# Altium schematic sheet 修改(3).SchDoc
size A4
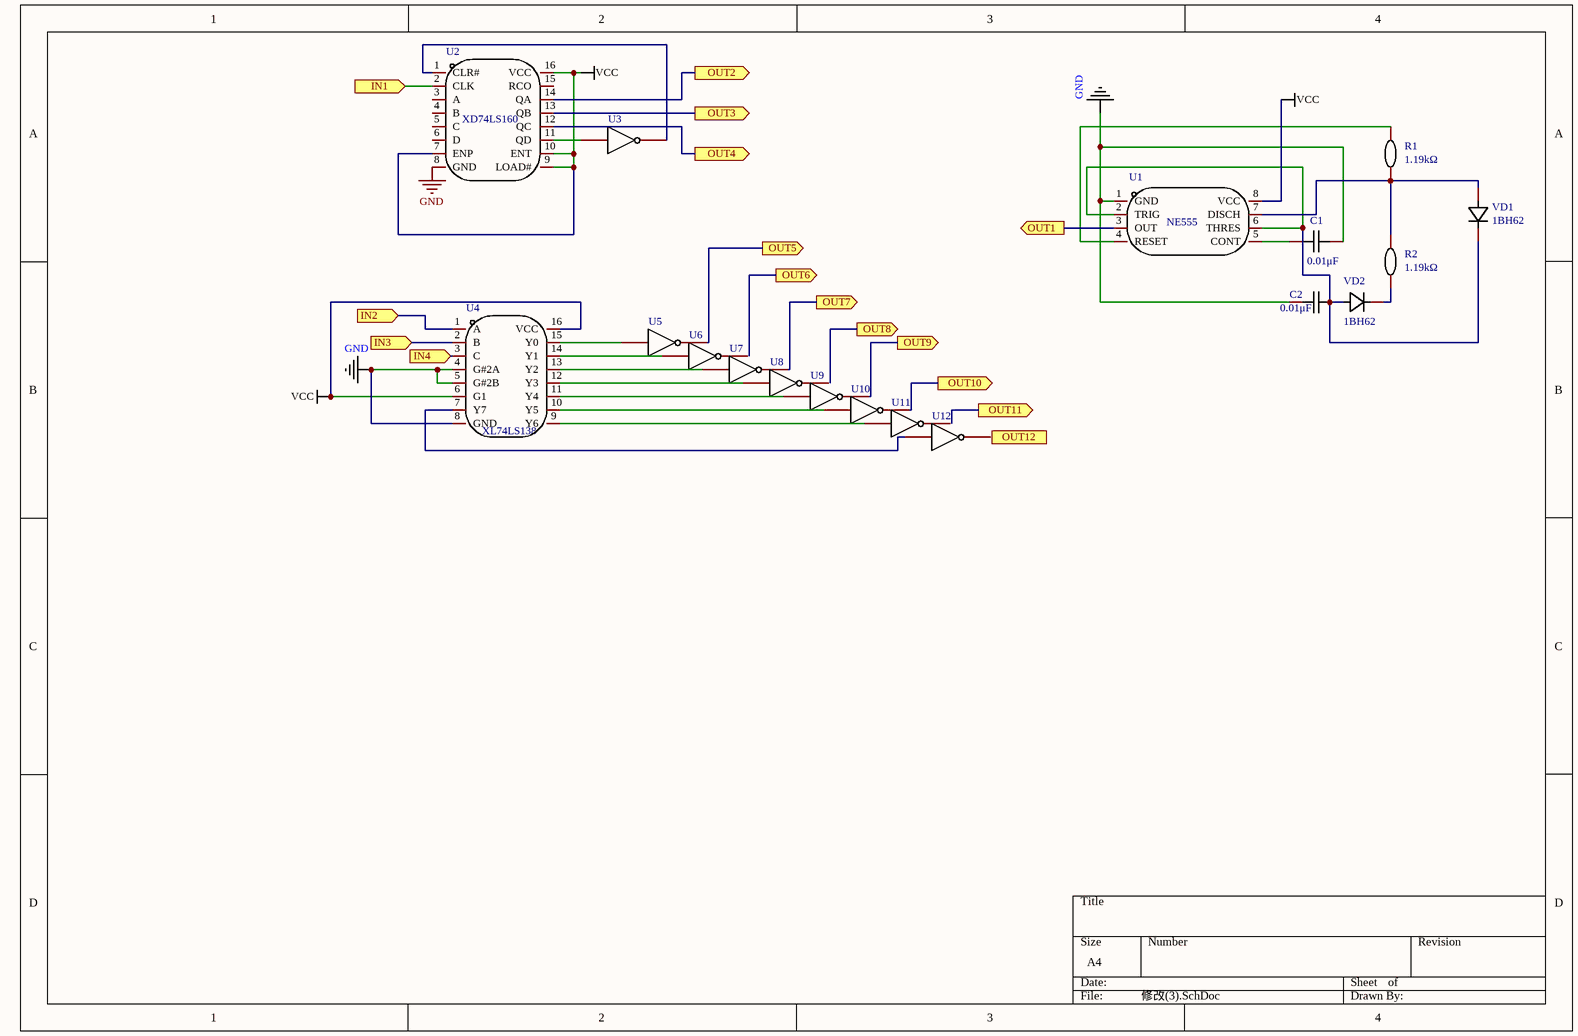
[diagram p0: 修改(3).SchDoc]

## Parts
C1  Name: 0.01μF  [C0603]  (hidden comment: 100nF)
C2  Name: 0.01μF  [C0603]  (hidden comment: 100nF)
R1  Name: 1.19kΩ  [R0603]  (hidden comment: 10K)
R2  Name: 1.19kΩ  [R0603]  (hidden comment: 10K)
U1  -  [SOIC-8_L4.9-W3.9-P1.27-LS6.0-BL]  (value not drawn)
U2  XD74LS160  [DIP-16_L19.8-W6.5-P2.54-LS7.6-BL]
U3  反相器  (value not drawn)
U4  XL74LS138  [SOP-16_L9.9-W3.9-P1.27-LS6.1-BL]
U5  反相器  (value not drawn)
U6  反相器  (value not drawn)
U7  反相器  (value not drawn)
U8  反相器  (value not drawn)
U9  反相器  (value not drawn)
U10  反相器  (value not drawn)
U11  反相器  (value not drawn)
U12  反相器  (value not drawn)
VD1  Name: 1BH62  [SMA_L4.3-W2.6-LS5.1-RD]  (hidden comment: 1N4007)
VD2  Name: 1BH62  [SMA_L4.3-W2.6-LS5.1-RD]  (hidden comment: 1N4007)

## Ports
IN1 (in), IN2 (in), IN3 (in), IN4 (in), OUT1 (out), OUT2 (out), OUT3 (out), OUT4 (out), OUT5 (out), OUT6 (out), OUT7 (out), OUT8 (out), OUT9 (out), OUT10 (out), OUT11 (out), OUT12 (out)

## Nets
GND: U2.8(GND)
NetC1_2: C1.2 C2.1 U1.1(GND) U4.4(G#2A) U4.5(G#2B) U4.8(GND)
VCC: U1.8(VCC) U2.7(ENP) U2.9(LOAD#) U2.10(ENT) U2.16(VCC) U4.6(G1) U4.16(VCC)
IN1: U2.2(CLK) ; port IN1
IN2: U4.1(A) ; port IN2
IN3: U4.2(B) ; port IN3
IN4: U4.3(C) ; port IN4
OUT1: U1.3(OUT) ; port OUT1
OUT2: U2.14(QA) ; port OUT2
OUT3: U2.13(QB) ; port OUT3
OUT4: U2.12(QC) ; port OUT4
OUT5: U5.2 ; port OUT5
OUT7: U7.2 ; port OUT7
OUT9: U9.2 ; port OUT9
OUT10: U10.2 ; port OUT10
NetC1_1: C1.1 U1.5(CONT)
NetC2_2: C2.2 U1.2(TRIG) U1.6(THRES) VD1.1(K) VD2.2(A)
NetR1_1: R1.1 R2.2 U1.7(DISCH) VD1.2(A)
NetR1_2: R1.2 U1.4(RESET)
NetR2_1: R2.1 VD2.1(K)
NetU2_1: U2.1(CLR#) U3.2
NetU2_11: U2.11(QD) U3.1
NetU4_7: U4.7(Y7) U12.1
NetU4_9: U4.9(Y6) U11.1
NetU4_10: U4.10(Y5) U10.1
NetU4_11: U4.11(Y4) U9.1
NetU4_12: U4.12(Y3) U8.1
NetU4_13: U4.13(Y2) U7.1
NetU4_14: U4.14(Y1) U6.1
NetU4_15: U4.15(Y0) U5.1

Not connected (* = marked no-connect by the designer): U2 3(A) 4(B) 5(C) 6(D) 15(RCO); U6 2; U8 2; U11 2; U12 2

## Notes on the sheet
- (near U1) NE555
- Labels drawn without touching a wire or pin: GND

## Library data of the parts
C1 C2 = CAP_0603: Symbol: CapAcitance; Convert to PCB: yes; Device: CAP_0603; Add into BOM: yes; Supplier Footprint: 0603; Value: 100nF
R1 R2 = Res_0603: Symbol: 电阻; Convert to PCB: yes; Device: Res_0603; Add into BOM: yes; Supplier Footprint: 0603; Value: 10K
U1 = NE555_C5125085: 频率:-;重置时间:-;是否可编程:-;; Manufacturer: IDCHIP(英锐芯); Manufacturer Part: NE555; Add into BOM: yes; Supply Voltage: 4.5V~15V; Supply Current: 220mA; Name: -; Symbol: NE555_C5125085; Device: NE555_C5125085; LCSC Part Name: NE555; Supplier Part: C5125085; Supplier Footprint: SOP-8; JLCPCB Part Class: Extended Part; Datasheet: https://atta.szlcsc.com/upload/public/pdf/source/20220809/79E25EAC0B22A7A3251D697544CF8E0B.pdf; Supplier: LCSC; Convert to PCB: yes; Value: -; Reset Time: -; Programmable: -; Operating Temperature: -
U2 = XD74LS160: 逻辑电路 计数器/分频器; Manufacturer: XINLUDA(信路达); Add into BOM: yes; Name: XD74LS160; Symbol: XD74LS160; Device: XD74LS160; LCSC Part Name: 计数器 IC; Supplier Part: C968687; Manufacturer Part: XD74LS160; Supplier Footprint: DIP-16; JLCPCB Part Class: 扩展库; Supplier: LCSC; Convert to PCB: yes
U3 U5-U12 = 反相器: Add into BOM: yes; Symbol: 反相器; Device: 反相器; Convert to PCB: yes
U4 = XL74LS138: 解码器/多路解器 低电平输出电流(IOL)：8mA 高电平输出电流(IOH)：400uA 供电电源：单电源 供电电压：4.75V~5.25V 3 线路到 8 线路解码器/多路解复用器; Manufacturer: XINLUDA(信路达); Add into BOM: yes; Name: XL74LS138; Symbol: XL74LS138; Device: XL74LS138; LCSC Part Name: 编码器、解码器、复用器和解复用器; Supplier Part: C513515; Manufacturer Part: XL74LS138; Supplier Footprint: SOP-16; JLCPCB Part Class: 扩展库; Datasheet: https://atta.szlcsc.com/upload/public/pdf/source/20200414/C513515_273A604EA9C73568A52BE133B962266B.pdf; Supplier: LCSC; Convert to PCB: yes
VD1 VD2 = 1N4007: Symbol: 1N4007_C9900004759; Add into BOM: yes; Device: 1N4007; LCSC Part Name: 1N4007; Supplier Part: C9900004759; Manufacturer Part: 1N4007; Supplier Footprint: SMA_L4.3-W2.6-LS5.1-RD; JLCPCB Part Class: Extended Part; Supplier: LCSC; Convert to PCB: yes